# EAGLE design FAE (EAGLE 9.0.1)
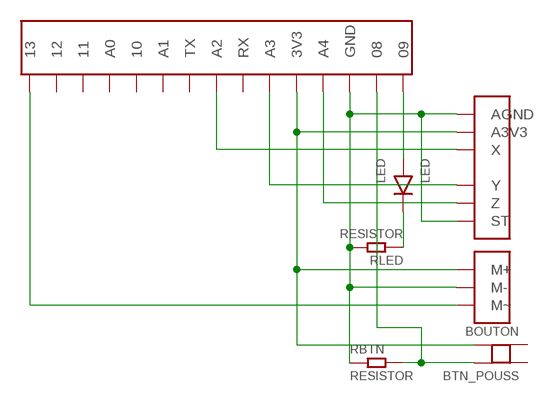
[diagram p0: schematic, sheet 1]

## Parts
BTN_POUSS  BOUTON  [BOUTON]
LED  LED  [LED]
RBTN  RESISTOR  [RESISTOR]
RLED  RESISTOR  [RESISTOR]
U$1  RAZOR_BOARD  [RAZOR_BOARD]
U$2  ADXL377  [ADXL377]
U$3  SERVO_ADAPT  [SERVO_ADAPT]

## Nets
N$1: LED.IN U$1.09
N$2: LED.OUT RLED.A
N$3: RBTN.A RLED.B U$1.GND U$2.AGND U$2.ST U$3.M-
N$4: BTN_POUSS.D U$1.3V3 U$2.A3.3V(A3V3) U$3.M+
N$5: BTN_POUSS.C RBTN.B U$1.08
N$6: U$1.13 U$3.M~
N$7: U$1.A2 U$2.X
N$8: U$1.A3 U$2.Y
N$9: U$1.A4 U$2.Z
Unconnected: BTN_POUSS.A BTN_POUSS.B U$1.10 U$1.11 U$1.12 U$1.A0 U$1.A1 U$1.RX U$1.TX

## Library data of the parts
BTN_POUSS = FAE:BOUTON
LED = FAE:LED
RBTN RLED = FAE:RESISTOR
U$1 = FAE:RAZOR_BOARD
U$2 = FAE:ADXL377
U$3 = FAE:SERVO_ADAPT

## Board
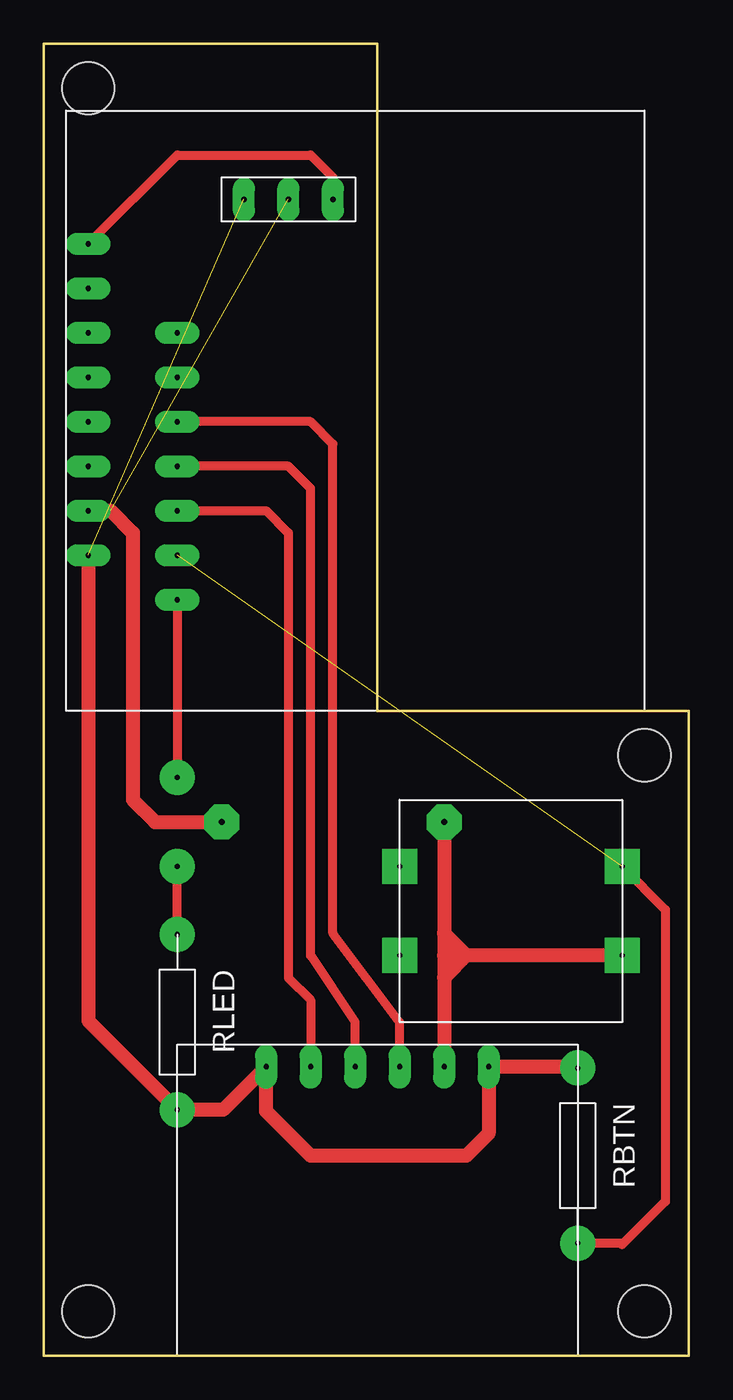
[diagram p1: board, top side]
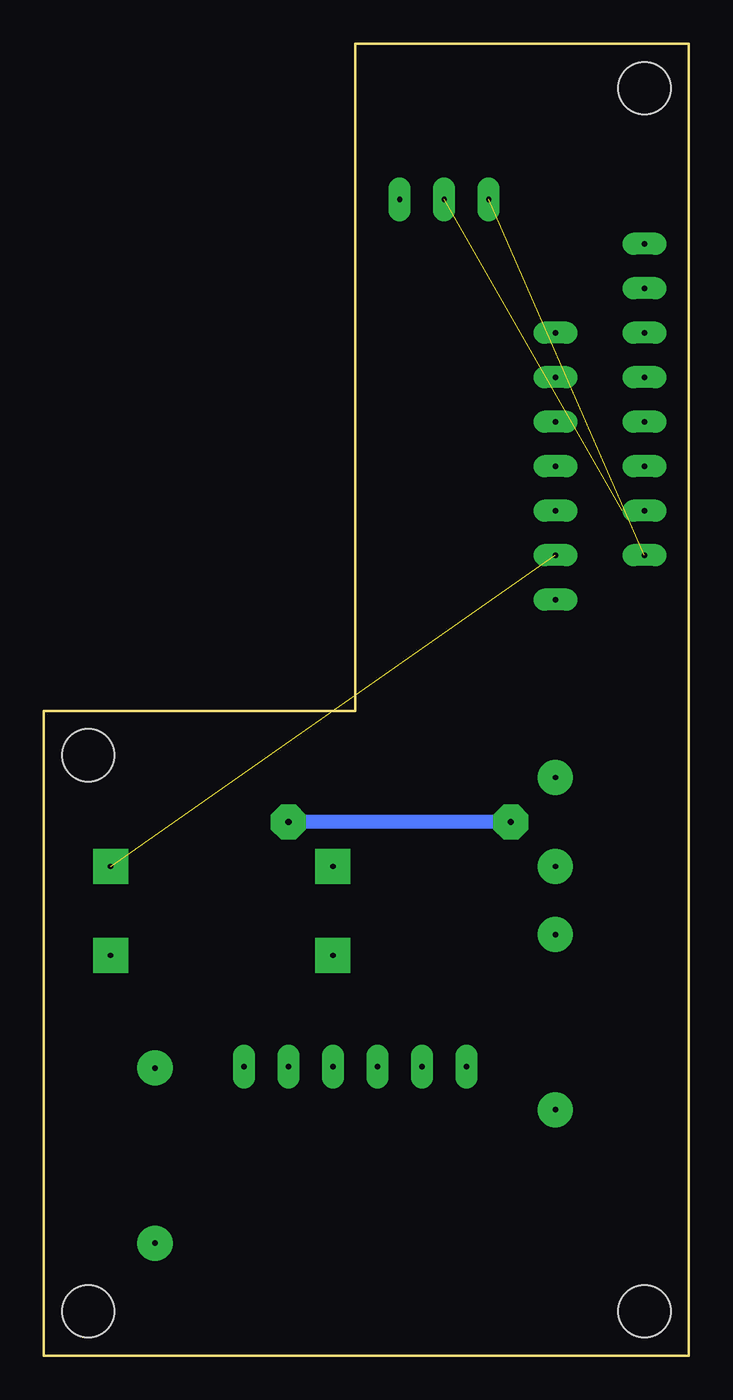
[diagram p2: board, bottom side, seen from below]

Size 36.83 x 74.93 mm. Coordinates in mm from the lower left corner, seen from the top.
Outline: 0,74.93 0,0 36.83,0 36.83,36.83 19.05,36.83 19.05,74.93 0,74.93
Copper layers (1*16): Top 0.035mm / dielectric 1.5mm / Bottom 0.035mm
Design rules "default": minimum track width 6mil, minimum drill 0.35mm, track to track 6mil, track to pad 6mil, pad to pad 6mil, via to via 6mil, smd to smd 6mil, copper to edge 40mil, drill to drill 6mil, minimum pad ring 10mil, minimum via ring 8mil, stop-mask expansion 4mil, vias tented up to drill 0mil, thermal gap 10mil
Holes 3 mm at 2.54,2.54 34.29,34.29 2.54,72.39 34.29,2.54

### Footprints (pad centres in the part's own frame; a part is rotated, then mirrored left to right if it is on the bottom)
BOUTON = drill 0.3 pad 2 square: A -6.35,2.54; B -6.35,-2.54; C 6.35,2.54; D 6.35,-2.54
LED = drill 0.3 pad 2: IN -2.54,0; OUT 2.54,0
RESISTOR = drill 0.3 pad 2: A -5,0; B 5,0
RAZOR_BOARD = drill 0.3 pad 1.27 long: 3V3 -2.54,-5.08; 08 2.54,-7.62; 09 2.54,-10.16; 10 -2.54,2.54; 11 -2.54,5.08; 12 -2.54,7.62; 13 -2.54,10.16; A0 2.54,5.08; A1 2.54,2.54; A2 2.54,0; A3 2.54,-2.54; A4 2.54,-5.08; GND -2.54,-7.62; RX -2.54,-2.54; TX -2.54,0
ADXL377 = drill 0.3 pad 1.27 long: A3.3V 0,3.81; AGND 0,6.35; ST 0,-6.35; X 0,1.27; Y 0,-1.27; Z 0,-3.81
SERVO_ADAPT = drill 0.3 pad 1.27 long: M+ 0,0; M- 0,2.54; M~ 0,-2.54

### Placement (x,y rotation side)
BTN_POUSS  26.67,25.4 0 top
LED  7.62,30.48 270 top
RBTN  30.48,11.43 270 top
RLED  7.62,19.05 270 top
U$1  5.08,53.34 0 top
U$2  19.05,16.51 270 top
U$3  13.97,66.04 90 top

### Tracks (layer width: path | path; a pad name or v marks a point on that pad's centre or on a via)
N$1
  Top 0.5: U$1.09 LED.IN
N$2
  Top 0.5: RLED.A LED.OUT
N$3  (1 unrouted)
  Top 0.8: U$1.GND 2.54,19.13 RLED.B 10.24,14.05 U$2.ST 12.7,13.97 15.24,11.43 24.13,11.43 25.4,12.7 U$2.AGND 30.4,16.51 RBTN.A
N$4  (via drill 0.35 pad 2)  (1 unrouted)
  Top 0.8: U$1.3V3 3.81,48.26 5.08,46.99 5.08,31.75 6.35,30.48 v10.16,30.48 | v22.86,30.48 22.86,24.13 | 22.86,24.13 22.86,22.86 | 22.86,22.86 22.86,21.59 | 22.86,21.59 U$2.A3.3V | BTN_POUSS.D 24.13,22.86 | 24.13,22.86 22.86,22.86 | 22.86,24.13 24.13,22.86 | 24.13,22.86 22.86,21.59
  Bottom 0.8: v10.16,30.48 v22.86,30.48
N$5  (1 unrouted)
  Top 0.5: BTN_POUSS.C 35.49,25.47 35.49,8.82 33.02,6.35 32.94,6.43 RBTN.B
N$6
  Top 0.5: U$3.M~ 16.51,67.31 15.24,68.58 7.62,68.58 U$1.13
N$7
  Top 0.5: U$2.X 20.32,19.05 16.51,24.13 16.51,52.07 15.24,53.34 U$1.A2
N$8
  Top 0.5: U$2.Y 17.78,19.05 15.24,22.86 15.24,49.53 13.97,50.8 U$1.A3
N$9
  Top 0.5: U$1.A4 12.7,48.26 13.97,46.99 13.97,21.59 15.24,20.32 U$2.Z